# EAGLE design NE555 (EAGLE 6.5.0)
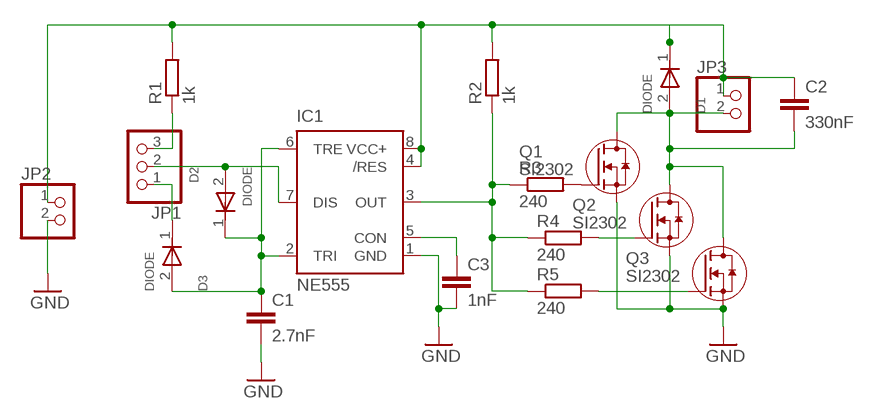
[diagram p0: schematic, sheet 1]

## Parts
C1  2.7nF  C-EUC0805  [C0805]
C2  330nF  C-EUC0805  [C0805]
C3  1nF  C-EUC0805  [C0805]
D1  DIODE  [SOD80]
D2  DIODE  [SOD80]
D3  DIODE  [SOD80]
IC1  NE555  [SO08]
JP1  PINHD-1X3  [1X03]
JP2  PINHD-1X2  [1X02]
JP3  PINHD-1X2  [1X02]
Q1  SI2302  [SOT-23-GSD]
Q2  SI2302  [SOT-23-GSD]
Q3  SI2302  [SOT-23-GSD]
R1  1k  R-EU_R0805  [R0805]
R2  1k  R-EU_R0805  [R0805]
R3  240  R-EU_R0805  [R0805]
R4  240  R-EU_R0805  [R0805]
R5  240  R-EU_R0805  [R0805]

## Nets
GND: C1.2 C3.2 IC1.1(GND) JP2.2 Q1.S Q2.S Q3.S
N$1: C2.1 D1.1(KATOD) IC1.4(/RES) IC1.8(VCC+) JP2.1 JP3.1 R1.2 R2.2
N$2: IC1.3(OUT) R2.1 R3.1 R4.1 R5.1
N$3: C2.2 D1.2(ANOD) JP3.2 Q1.D Q2.D Q3.D
N$4: Q1.G R3.2
N$5: Q2.G R4.2
N$7: Q3.G R5.2
N$9: C3.1 IC1.5(CON)
N$10: C1.1 D2.1(KATOD) D3.2(ANOD) IC1.2(TRI) IC1.6(TRE)
N$12: D2.2(ANOD) IC1.7(DIS) JP1.2
N$13: JP1.3 R1.1
N$14: D3.1(KATOD) JP1.1

## Library data of the parts
C1-C3 = rcl:C-EU: CAPACITOR, European symbol
D1-D3 = usb:DIODE: DIODE
IC1 = usb:NE555: General purpose bipolar Timer
JP1 = pinhead:PINHD-1X3: PIN HEADER
JP2 JP3 = pinhead:PINHD-1X2: PIN HEADER
Q1-Q3 = usb:SI2302: N-канальный полевик
R1-R5 = rcl:R-EU_: RESISTOR, European symbol

## Board
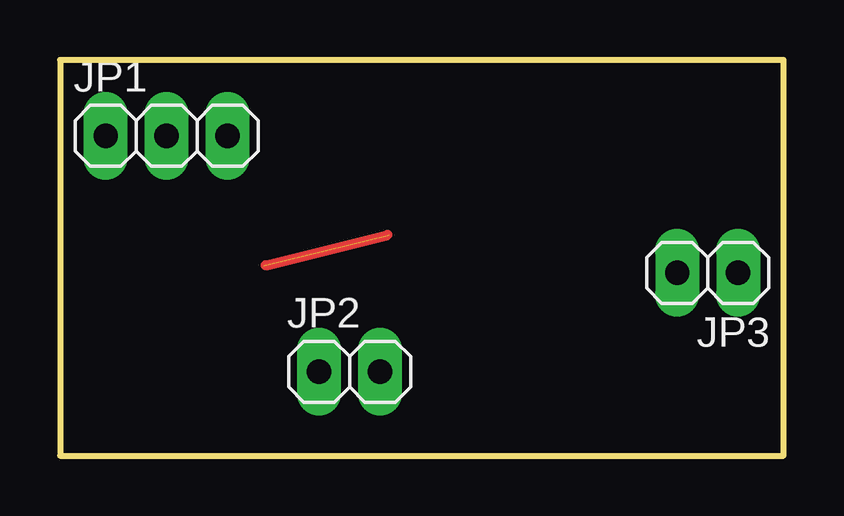
[diagram p1: board, top side]
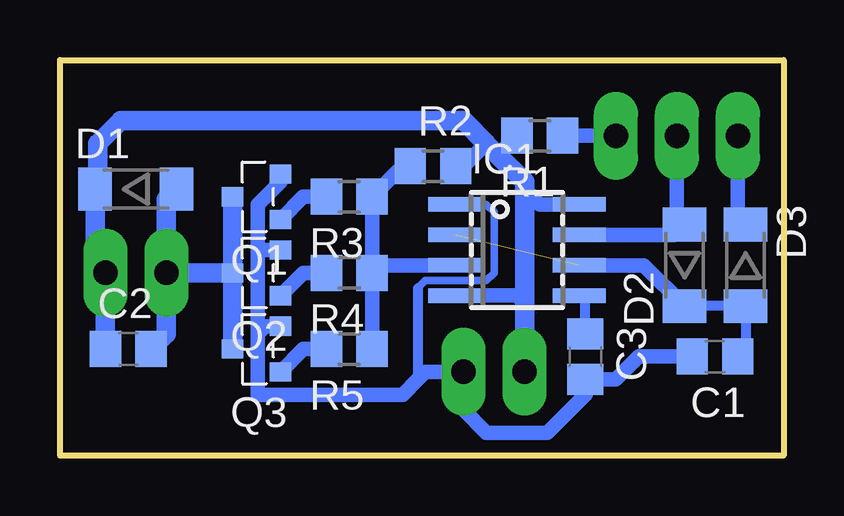
[diagram p2: board, bottom side, seen from below]

Size 30.15 x 16.5 mm. Coordinates in mm from the lower left corner, seen from the top.
Outline: 0,0 30.15,0 30.15,16.5 0,16.5 0,0
Copper layers (1*16): Top 0.035mm / dielectric 1.5mm / Bottom 0.035mm
Design rules "default": minimum track width 12mil, minimum drill 32mil, track to track 12mil, track to pad 12mil, pad to pad 12mil, via to via 12mil, smd to smd 8mil, copper to edge 40mil, drill to drill 8mil, minimum pad ring 16mil, minimum via ring 12mil, stop-mask expansion 4mil, vias tented up to drill 0mil, thermal gap 20mil

### Footprints (pad centres in the part's own frame; a part is rotated, then mirrored left to right if it is on the bottom)
C0805 = smd 1.3 x 1.5: 1 -0.95,0; 2 0.95,0
SOD80 = smd 1.4 x 1.8: 1 -1.7,0; 2 1.7,0
SO08 = smd 0.6 x 2.2: 1 -1.905,-2.6; 2 -0.635,-2.6; 3 0.635,-2.6; 4 1.905,-2.6; 5 1.905,2.6; 6 0.635,2.6; 7 -0.635,2.6; 8 -1.905,2.6
1X03 = drill 1.016 long: 1 -2.54,0; 2 0,0; 3 2.54,0
1X02 = drill 1.016 long: 1 -1.27,0; 2 1.27,0
SOT-23-GSD = smd 0.8 x 0.9: D 0,2; G -0.95,0; S 0.95,0
R0805 = smd 1.3 x 1.5: 1 -0.95,0; 2 0.95,0

### Placement (x,y rotation side)
C1  2.86,4.13 180 bottom
C2  27.3,4.45 0 bottom
C3  8.26,4.13 270 bottom
D1  26.99,11.11 0 bottom
D2  4.13,7.94 90 bottom
D3  1.59,7.94 270 bottom
IC1  11.11,8.57 270 bottom
JP1  4.45,13.34 0 top
JP2  12.06,3.49 0 top
JP3  26.99,7.62 180 top
Q1  20.95,10.79 90 bottom
Q2  20.95,7.62 90 bottom
Q3  20.95,4.45 90 bottom
R1  10.16,13.34 180 bottom
R2  14.61,12.06 0 bottom
R3  18.1,10.79 180 bottom
R4  18.1,7.62 180 bottom
R5  18.1,4.45 180 bottom

### Tracks (layer width: path | path; a pad name or v marks a point on that pad's centre or on a via)
GND
  Bottom 0.305: IC1.1 12.38,10.48 12.06,10.16 12.06,7.62 12.38,7.3 14.92,7.3 15.24,6.99
  Bottom 0.406: C3.2 7.62,3.18 | 15.24,6.99 15.24,3.17
  Bottom 0.61: Q1.S 20.95,11.43 21.91,10.48 21.91,8.57 | 21.91,8.57 21.91,5.08 | 21.91,5.08 21.91,2.54 15.88,2.54 15.24,3.17 14.92,3.49 JP2.2 13.34,1.91 12.38,0.95 9.84,0.95 8.25,2.54 C3.2 | Q3.S 21.59,5.39 21.91,5.08 | Q2.S 21.91,8.57 | C1.2 6.03,4.13 6.99,3.17 C3.2 | C3.2
N$1
  Bottom 0.406: IC1.4 12.7,6.67
  Bottom 0.61: R1.2 11.91,12.54 | R2.2 13.34,12.06 12.38,13.02 | IC1.8 10.16,10.48 10.79,11.11 | 12.7,6.67 11.11,6.67 10.79,6.35
  Bottom 0.813: JP2.1 10.79,6.35 10.79,11.11 10.79,11.43 11.91,12.54 12.38,13.02 13.34,13.97 27.62,13.97 28.57,13.02 28.57,11.22 D1.1 28.69,8.05 JP3.1 C2.1
N$2
  Bottom 0.406: 16.83,10.48 R3.1
  Bottom 0.61: IC1.3 16.83,7.94 R4.1 | R2.1 15.88,12.06 R3.1 R4.1 | R4.1 R5.1
N$3
  Bottom 0.61: 24.97,10.79 D1.2
  Bottom 0.813: Q2.D Q3.D | Q2.D Q1.D | Q2.D JP3.2 | JP3.2 25.72,10.68 D1.2 | JP3.2 25.72,5.08 C2.2
N$4
  Bottom 0.61: R3.2 20,10.79 Q1.G
N$5
  Bottom 0.61: R4.2 20,7.62 Q2.G
N$6
  Top 0.406: 8.57,7.94 13.65,9.21
N$7
  Bottom 0.61: R5.2 20,4.45 Q3.G
N$9
  Bottom 0.406: C3.1 8.26,6.41 IC1.5
N$10  (1 unrouted)
  Bottom 0.406: 4.33,6.24 D2.1 D3.2 1.59,4.45 C1.1
  Bottom 0.61: IC1.6 5.83,7.94 D2.1
N$12
  Bottom 0.61: JP1.2 4.45,9.96 D2.2 4.56,9.21 IC1.7
N$13
  Bottom 0.61: JP1.3 R1.1
N$14
  Bottom 0.61: JP1.1 1.91,9.96 D3.1